# EAGLE design scem (EAGLE 9.5.2)
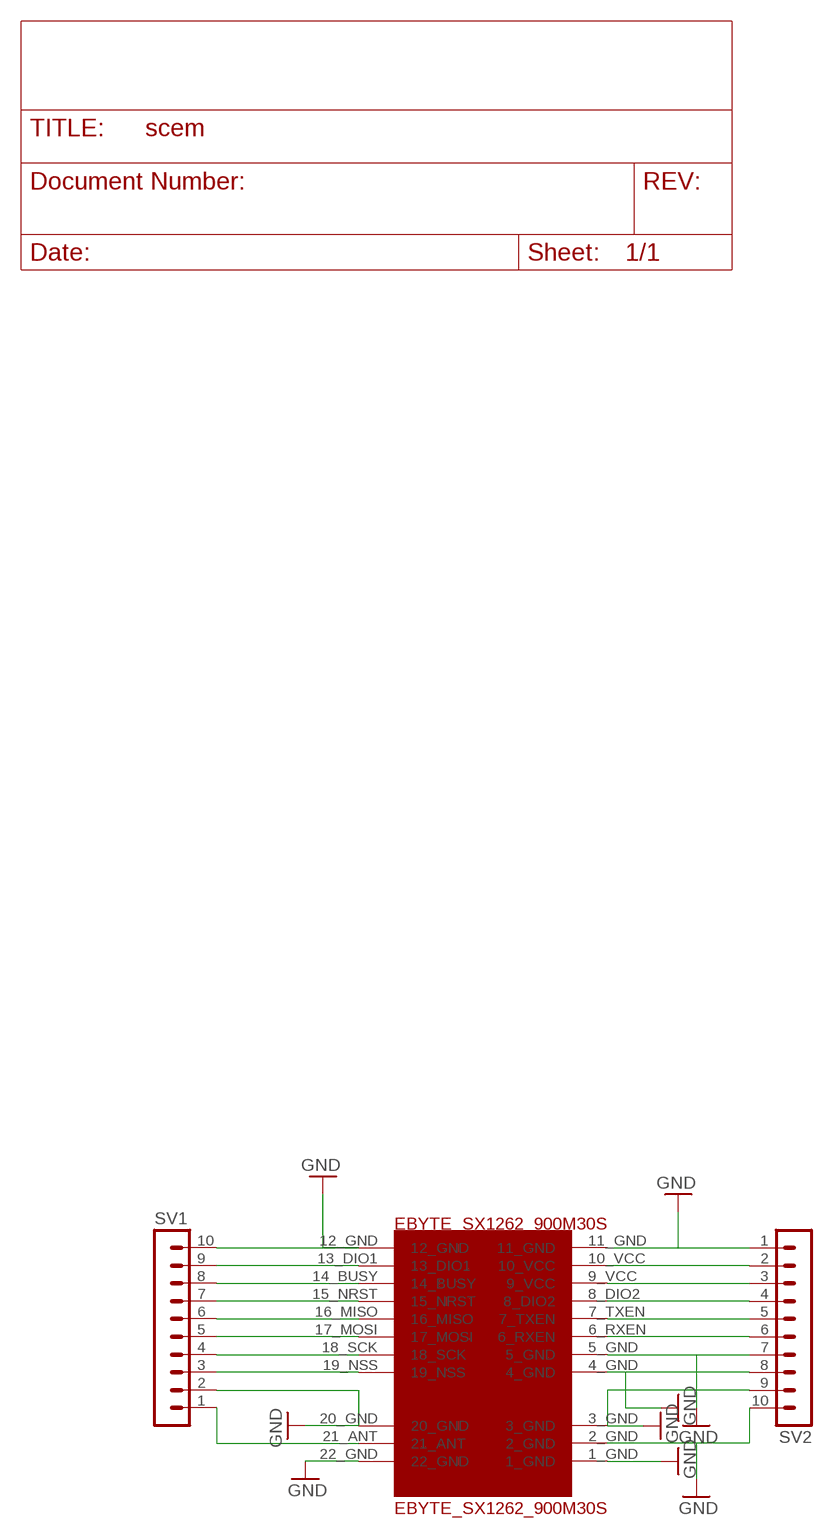
[diagram p0: schematic, sheet 1]

## Parts
EBYTE_SX1262_900M30S  EBYTE_SX1262_900M30S  [EBYTE_SX1262_900M30S_FOOTPRINT]
SV1  MA10-1  [MA10-1]
SV2  MA10-1  [MA10-1]

## Nets
GND: EBYTE_SX1262_900M30S.1_GND EBYTE_SX1262_900M30S.2_GND EBYTE_SX1262_900M30S.3_GND EBYTE_SX1262_900M30S.4_GND EBYTE_SX1262_900M30S.5_GND EBYTE_SX1262_900M30S.11_GND EBYTE_SX1262_900M30S.12_GND EBYTE_SX1262_900M30S.20_GND EBYTE_SX1262_900M30S.22_GND SV1.2 SV1.10 SV2.1 SV2.7 SV2.8 SV2.9 SV2.10
N$2: EBYTE_SX1262_900M30S.13_DIO1 SV1.9
N$3: EBYTE_SX1262_900M30S.14_BUSY SV1.8
N$4: EBYTE_SX1262_900M30S.15_NRST SV1.7
N$5: EBYTE_SX1262_900M30S.16_MISO SV1.6
N$6: EBYTE_SX1262_900M30S.17_MOSI SV1.5
N$7: EBYTE_SX1262_900M30S.18_SCK SV1.4
N$8: EBYTE_SX1262_900M30S.19_NSS SV1.3
N$10: EBYTE_SX1262_900M30S.21_ANT SV1.1
N$12: EBYTE_SX1262_900M30S.10_VCC SV2.2
N$13: EBYTE_SX1262_900M30S.9_VCC SV2.3
N$14: EBYTE_SX1262_900M30S.8_DIO2 SV2.4
N$15: EBYTE_SX1262_900M30S.7_TXEN SV2.5
N$16: EBYTE_SX1262_900M30S.6_RXEN SV2.6

## Library data of the parts
EBYTE_SX1262_900M30S = cust_parts:EBYTE_SX1262_900M30S
SV1 SV2 = con-lstb:MA10-1: PIN HEADER; OC_FARNELL: unknown; OC_NEWARK: unknown

## Board
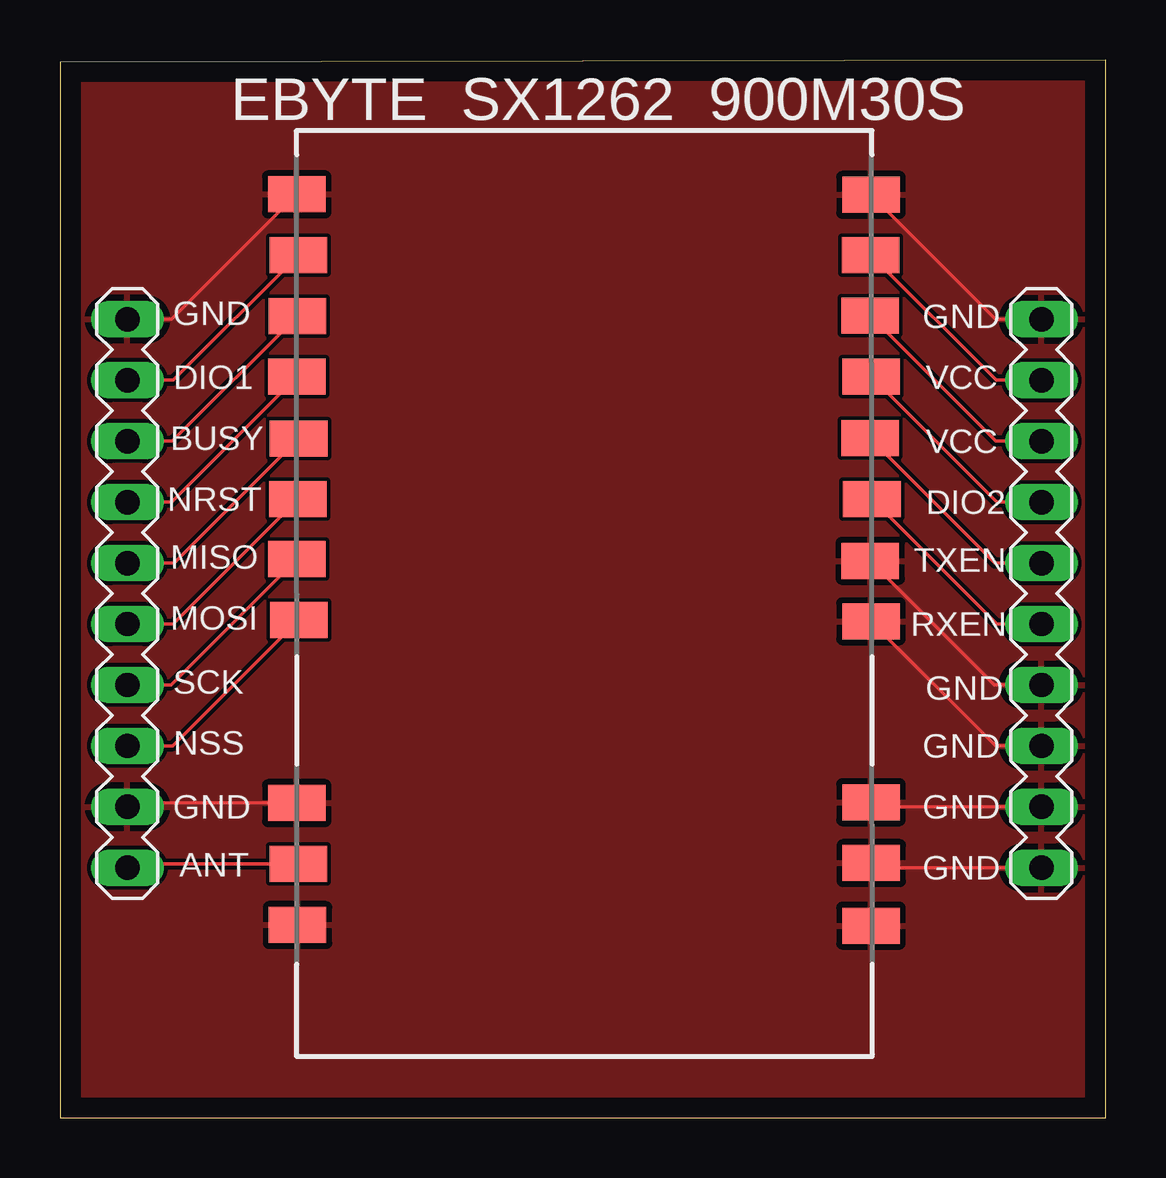
[diagram p1: board, top side]
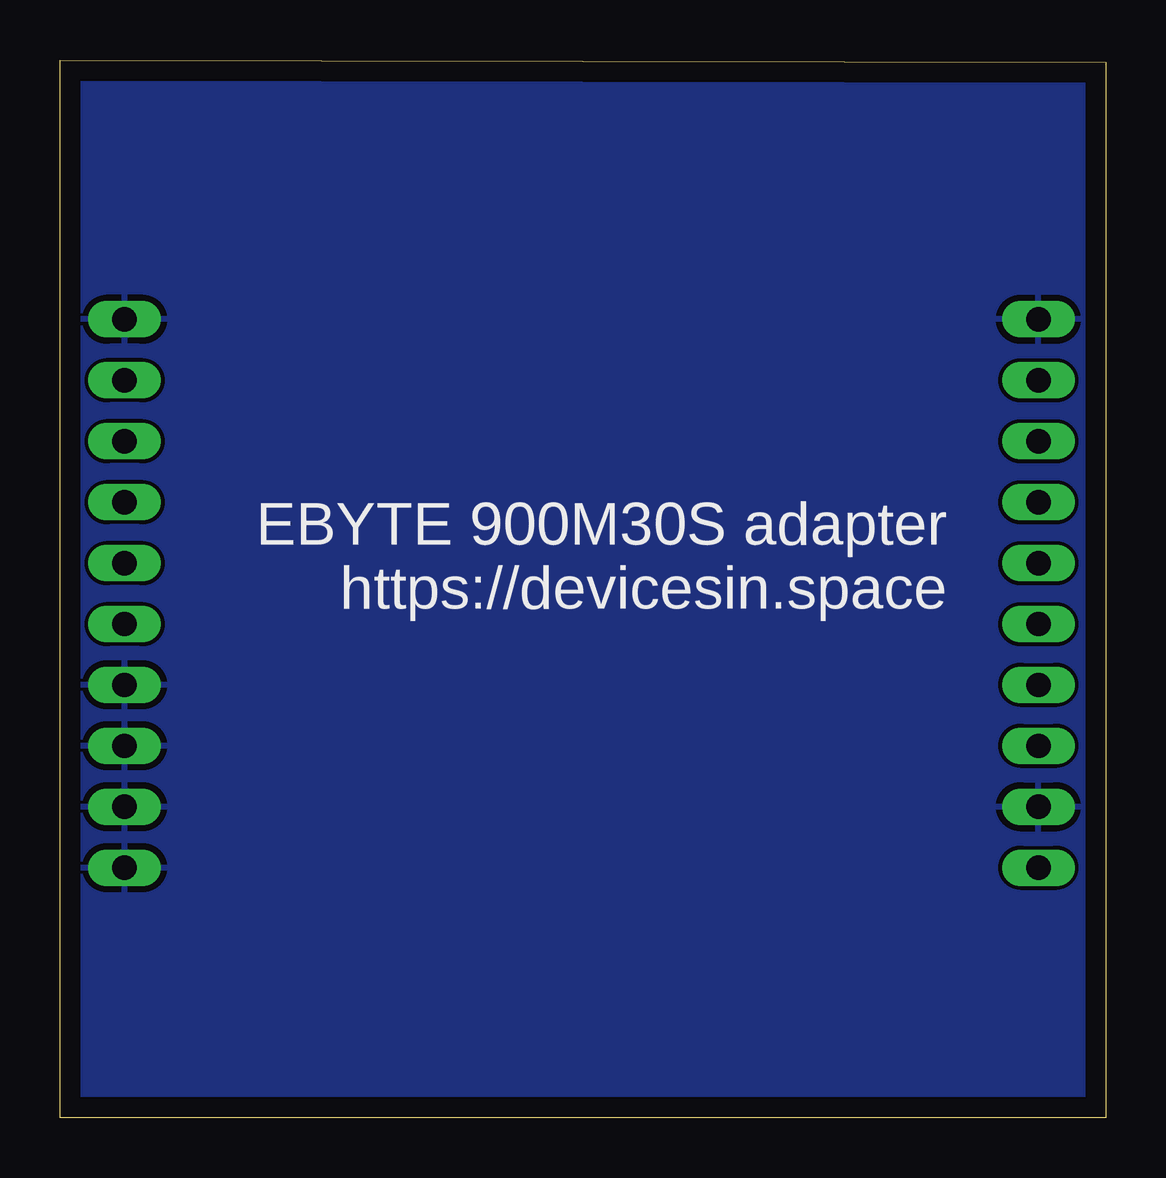
[diagram p2: board, bottom side, seen from below]

Size 43.6 x 44.1 mm. Coordinates in mm from the lower left corner, seen from the top.
Outline: 0,0 43.6,0 43.6,44.1 0,44 0,0
Copper layers (1*16): Top 0.035mm / dielectric 1.5mm / Bottom 0.035mm
Design rules "default *": minimum track width 6mil, minimum drill 0.35mm, track to track 6mil, track to pad 6mil, pad to pad 6mil, via to via 6mil, smd to smd 6mil, copper to edge 0.85mm, drill to drill 6mil, minimum pad ring 10mil, minimum via ring 8mil, stop-mask expansion 4mil, vias tented up to drill 0mil, thermal gap 10mil

### Footprints (pad centres in the part's own frame; a part is rotated, then mirrored left to right if it is on the bottom)
EBYTE_SX1262_900M30S_FOOTPRINT = smd 2.4 x 1.5: 1_GND 11.946,-13.848; 2_GND 11.953,-11.232; 3_GND 11.946,-8.7; 4_GND 11.946,-1.155; 5_GND 11.915,1.361; 6_RXEN 11.984,3.939; 7_TXEN 11.907,6.479; 8_DIO2 11.953,9.049; 9_VCC 11.915,11.589; 10_VCC 11.938,14.113; 11_GND 11.946,16.622; 12_GND -11.991,16.645; 13_DIO1 -11.917,14.112; 14_BUSY -11.965,11.563; 15_NRST -11.986,9.038; 16_MISO -11.914,6.456; 17_MOSI -11.937,3.938; 18_SCK -11.986,1.435; 19_NSS -11.907,-1.1; 20_GND -11.992,-8.731; 21_ANT -11.93,-11.263; 22_GND -11.961,-13.818
MA10-1 = drill 1.016 long: 1 -11.43,0; 2 -8.89,0; 3 -6.35,0; 4 -3.81,0; 5 -1.27,0; 6 1.27,0; 7 3.81,0; 8 6.35,0; 9 8.89,0; 10 11.43,0

### Placement (x,y rotation side)
EBYTE_SX1262_900M30S  21.86,21.86 0 top
SV1  2.81,21.86 90 top
SV2  40.91,21.86 270 top

### Tracks (layer width: path | path; a pad name or v marks a point on that pad's centre or on a via)
GND
  Top 0.152: SV1.2 2.97,13.13 EBYTE_SX1262_900M30S.20_GND 10.03,12.97 | SV1.10 4.66,33.29 EBYTE_SX1262_900M30S.12_GND 10.01,38.37 | SV2.1 39,33.29 EBYTE_SX1262_900M30S.11_GND 33.7,38.37 | SV2.7 38.95,18.05 EBYTE_SX1262_900M30S.5_GND 33.69,23.13 | SV2.8 39,15.51 EBYTE_SX1262_900M30S.4_GND 33.69,20.59 | SV2.10 34.01,10.43 EBYTE_SX1262_900M30S.2_GND 33.62,10.43 | SV2.9 34,12.97 EBYTE_SX1262_900M30S.3_GND 33.62,12.97
  pour Top: -3,45.72 45.72,45.72 45.72,-2 -3,-2
  pour Bottom: -2,46.72 47.72,46.72 47.72,-1 -2,-1
N$2
  Top 0.152: SV1.9 4.72,30.75 EBYTE_SX1262_900M30S.13_DIO1
N$3
  Top 0.152: SV1.8 4.68,28.21 EBYTE_SX1262_900M30S.14_BUSY
N$4
  Top 0.152: SV1.7 4.65,25.67 EBYTE_SX1262_900M30S.15_NRST
N$5
  Top 0.152: SV1.6 4.76,23.13 EBYTE_SX1262_900M30S.16_MISO
N$6
  Top 0.152: SV1.5 4.72,20.59 EBYTE_SX1262_900M30S.17_MOSI
N$7
  Top 0.152: SV1.4 4.63,18.05 EBYTE_SX1262_900M30S.18_SCK
N$8
  Top 0.152: SV1.3 4.7,15.51 EBYTE_SX1262_900M30S.19_NSS
N$10
  Top 0.152: SV1.1 2.98,10.6 EBYTE_SX1262_900M30S.21_ANT
N$12
  Top 0.152: SV2.2 39.02,30.75 EBYTE_SX1262_900M30S.10_VCC
N$13
  Top 0.152: SV2.3 39.02,28.21 EBYTE_SX1262_900M30S.9_VCC
N$14
  Top 0.152: SV2.4 39.05,25.67 EBYTE_SX1262_900M30S.8_DIO2
N$15
  Top 0.152: SV2.5 38.98,23.13 EBYTE_SX1262_900M30S.7_TXEN
N$16
  Top 0.152: SV2.6 39.05,20.59 EBYTE_SX1262_900M30S.6_RXEN

### Text on the board
tPlace: GND | GND | DIO1 | VCC | BUSY | VCC | NRST | DIO2 | MISO | TXEN | MOSI | RXEN | SCK | GND | NSS | GND | GND | GND | ANT | GND
bPlace: EBYTE 900M30S adapter / https://devicesin.space